# Altium schematic sheet shared_name_label.SchDoc
size A4
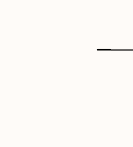
[diagram p0: shared_name_label.SchDoc, top left]
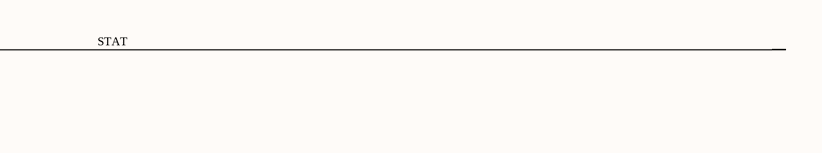
[diagram p1: shared_name_label.SchDoc, top right]
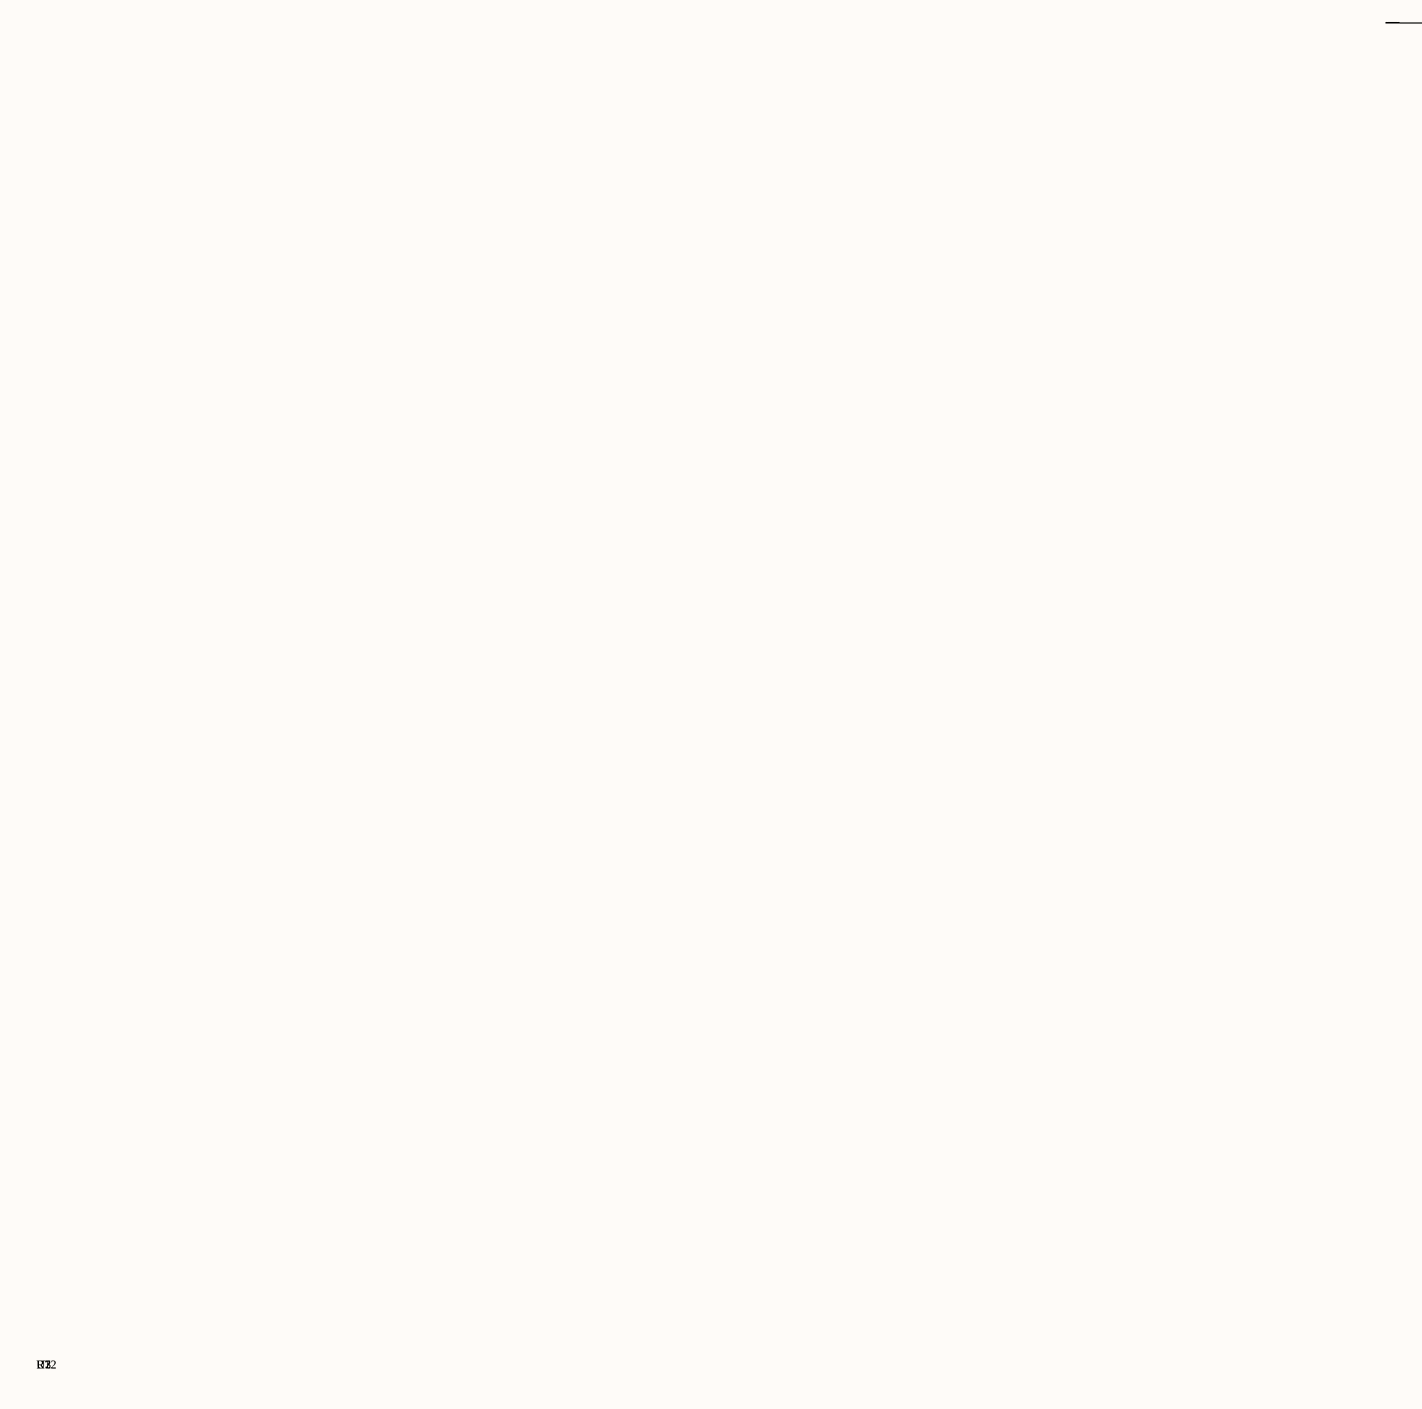
[diagram p2: shared_name_label.SchDoc, bottom left]
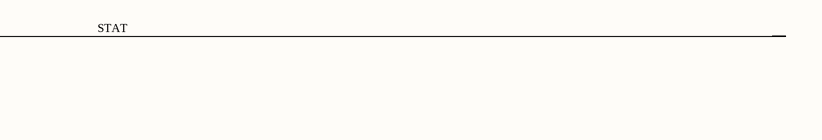
[diagram p3: shared_name_label.SchDoc, bottom right]

## Parts
R7  (no value)
R12  (no value)
U2  (no value)
U3  (no value)

## Nets
STAT: R7.1(A) R12.1(B) U2.1(STAT) U3.2(LED)

## Library data of the parts
R7 R12 U2 U3 = DEVICE